# EAGLE design main (EAGLE 6.1)
AUTHOR: Chaiporn Jaikaeo; REV: 1
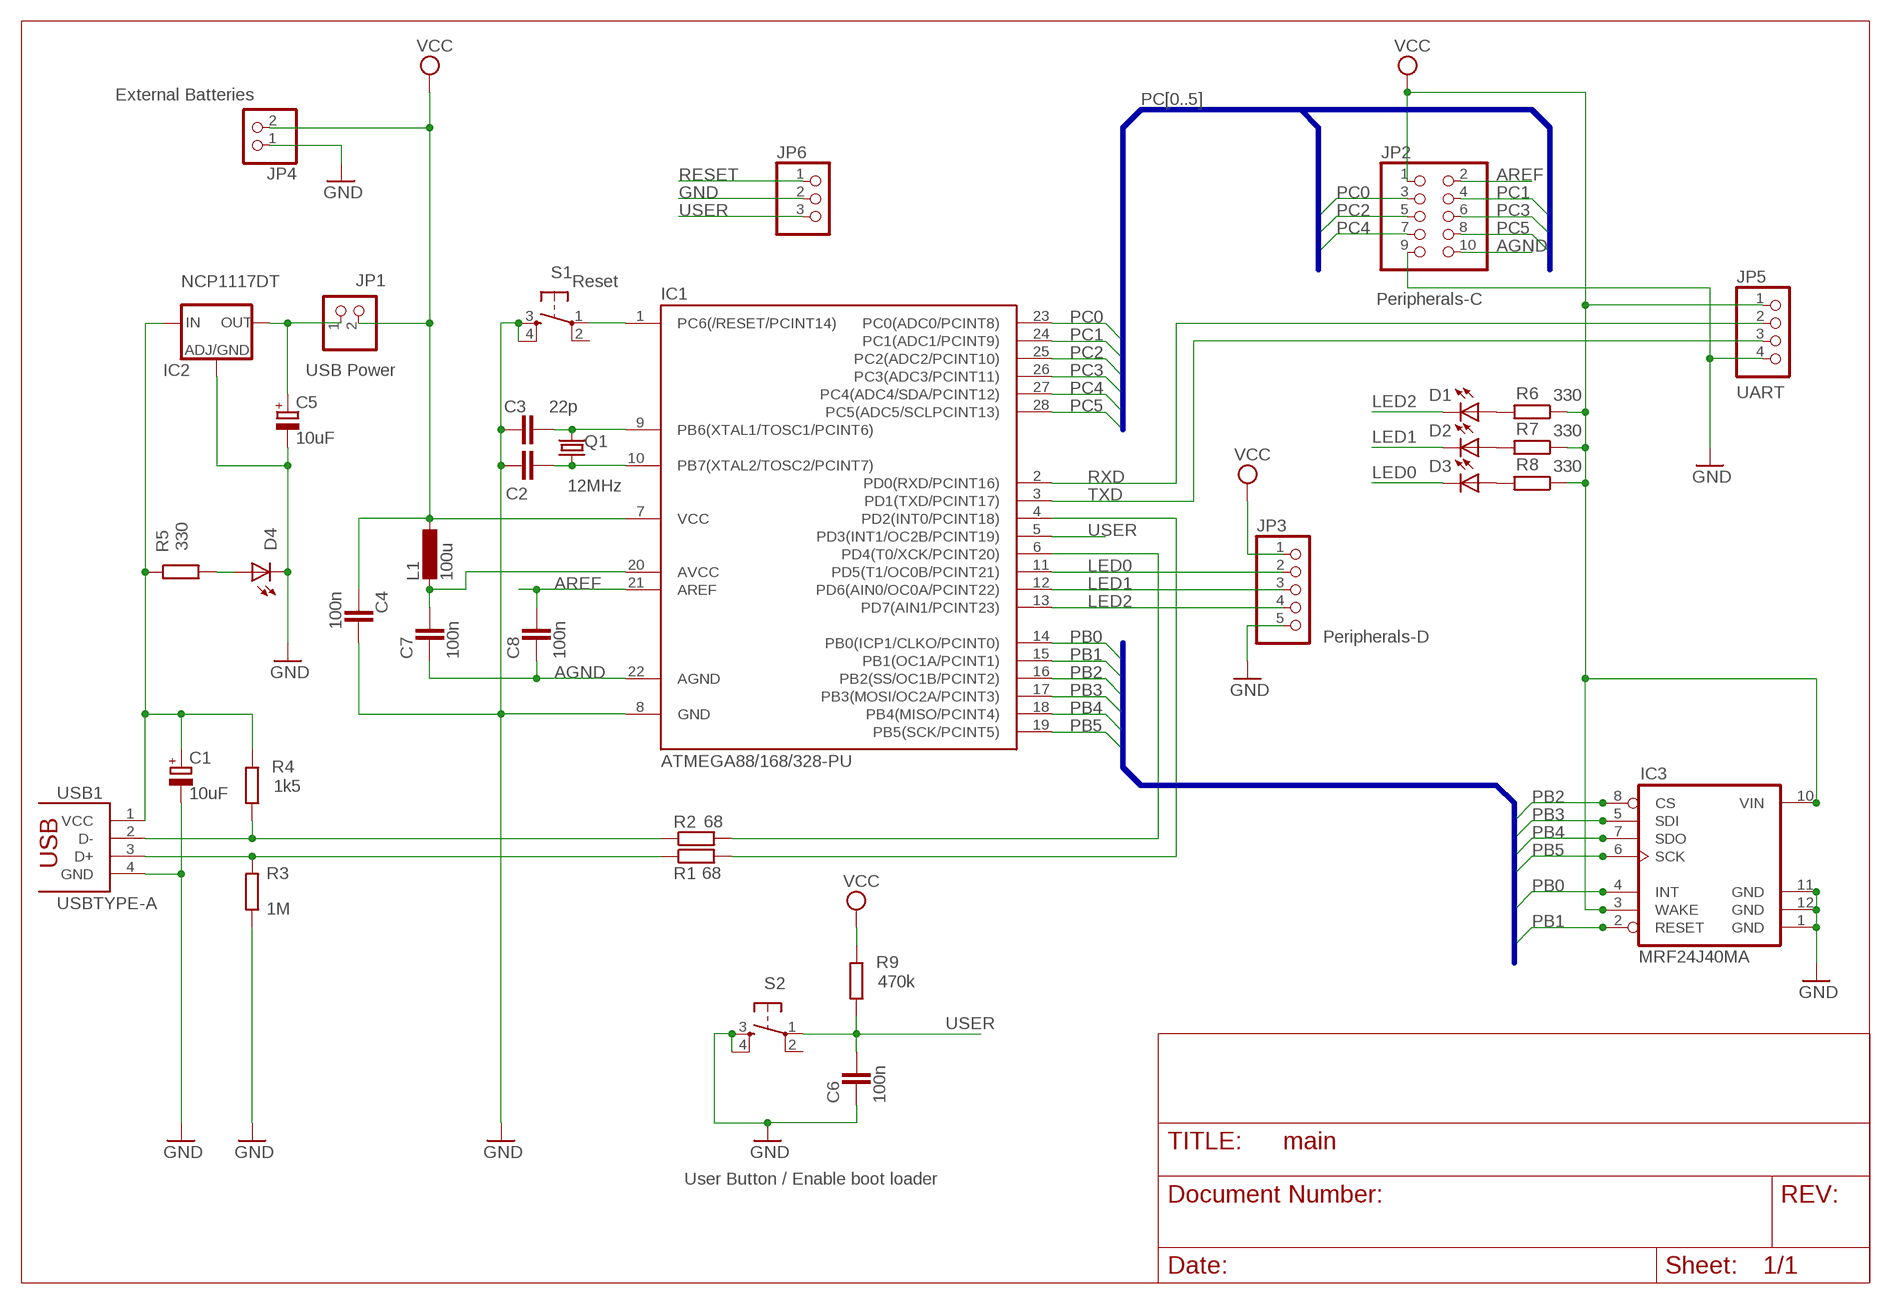
[diagram p0: schematic, sheet 1]

## Parts
C1  10uF  CPOL-EUE2,5-6E  [E2,5-6E]
C2  22p  C-EU025-024X044  [C025-024X044]
C3  22p  C-EU025-024X044  [C025-024X044]
C4  100n  C-EU050-024X044  [C050-024X044]
C5  10uF  CPOL-EUE2,5-6E  [E2,5-6E]
C6  100n  C-EU050-024X044  [C050-024X044]
C7  100n  C-EU050-024X044  [C050-024X044]
C8  100n  C-EU050-024X044  [C050-024X044]
D1  LED3MM  [LED3MM]
D2  LED3MM  [LED3MM]
D3  LED3MM  [LED3MM]
D4  LED3MM  [LED3MM]
IC1  ATMEGA88/168/328-PU  ATMEGA48/88/168-PU  [DIL28-3]
IC2  NCP1117DT  [DPACK]
IC3  MRF24J40MA/B/C  MRF24J40MAB  [MRF24J40MAB-TH]
JP1  PINHD-1X2  [1X02]
JP2  HEADER-2X5  [2X05]
JP3  PINHD-1X5  [1X05]
JP4  PINHD-1X2  [1X02]
JP5  HEADER-1X4ROUND  [1X04_ROUND]
JP6  PINHD-1X3  [1X03]
L1  100u  L-EU0207/7  [0207/7]
Q1  12MHz  CRYSTALHC49S  [HC49/S]
R1  68  R-EU_0204/5  [0204/5@1]
R2  68  R-EU_0204/5  [0204/5@1]
R3  1M  R-EU_0204/5  [0204/5@1]
R4  1k5  R-EU_0204/5  [0204/5@1]
R5  330  R-EU_0204/7  [0204/7@1]
R6  330  R-EU_0204/5  [0204/5@1]
R7  330  R-EU_0204/5  [0204/5@1]
R8  330  R-EU_0204/5  [0204/5@1]
R9  470k  R-EU_0204/5  [0204/5@1]
S1  DTS-6  [DTS-6]
S2  DTS-6  [DTS-6]
USB1  USBTYPE-A  [USBTYPE-A]

## Nets
AGND: C7.1 C8.1 IC1.22(AGND) JP2.10
AREF: C8.2 IC1.21(AREF) JP2.2
D+: R1.1 R3.2 USB1.3(D+)
D-: R2.1 R4.2 USB1.2(D-)
GND [power]: C1.- C2.1 C3.1 C4.2 C5.- C6.1 D4.K(C) IC1.8(GND) IC2.1(ADJ) IC3.1(GND) IC3.11(GND) IC3.12(GND) IC3.13(GND) IC3.23(GND) IC3.24(GND) JP2.9 JP3.5 JP4.1 JP5.4 JP6.2 R3.1 S1.3 S1.4 S2.3 S2.4 USB1.4(GND)
LED0: D3.K(C) IC1.11(PD5(T1/OC0B/PCINT21)) JP3.2
LED1: D2.K(C) IC1.12(PD6(AIN0/OC0A/PCINT22)) JP3.3
LED2: D1.K(C) IC1.13(PD7(AIN1/PCINT23)) JP3.4
N$1: IC1.4(PD2(INT0/PCINT18)) R1.2
N$3: IC1.6(PD4(T0/XCK/PCINT20)) R2.2
N$4 [power]: C5.+ IC2.4(OUT) JP1.1
N$5: D1.A R6.2
N$6: C7.2 IC1.20(AVCC) L1.1
N$7: D2.A R7.2
N$8: D3.A R8.2
N$9: C2.2 IC1.10(PB7(XTAL2/TOSC2/PCINT7)) Q1.1
N$10: C3.2 IC1.9(PB6(XTAL1/TOSC1/PCINT6)) Q1.2
N$12 [power]: C1.+ IC2.3(IN) R4.1 R5.1 USB1.1(VCC)
N$14: D4.A R5.2
PB0: IC1.14(PB0(ICP1/CLKO/PCINT0)) IC3.4(INT) IC3.16(INT)
PB1: IC1.15(PB1(OC1A/PCINT1)) IC3.2(RESET) IC3.14(RESET)
PB2: IC1.16(PB2(SS/OC1B/PCINT2)) IC3.8(CS) IC3.20(CS)
PB3: IC1.17(PB3(MOSI/OC2A/PCINT3)) IC3.5(SDI) IC3.17(SDI)
PB4: IC1.18(PB4(MISO/PCINT4)) IC3.7(SDO) IC3.19(SDO)
PB5: IC1.19(PB5(SCK/PCINT5)) IC3.6(SCK) IC3.18(SCK)
PC0: IC1.23(PC0(ADC0/PCINT8)) JP2.3
PC1: IC1.24(PC1(ADC1/PCINT9)) JP2.4
PC2: IC1.25(PC2(ADC2/PCINT10)) JP2.5
PC3: IC1.26(PC3(ADC3/PCINT11)) JP2.6
PC4: IC1.27(PC4(ADC4/SDA/PCINT12)) JP2.7
PC5: IC1.28(PC5(ADC5/SCLPCINT13)) JP2.8
RESET: IC1.1(PC6(/RESET/PCINT14)) JP6.1 S1.1
RXD: IC1.2(PD0(RXD/PCINT16)) JP5.2
TXD: IC1.3(PD1(TXD/PCINT17)) JP5.3
USER: C6.2 IC1.5(PD3(INT1/OC2B/PCINT19)) JP6.3 R9.2 S2.1
VCC [power]: C4.1 IC1.7(VCC) IC3.3(WAKE) IC3.10(VIN) IC3.15(WAKE) IC3.22(VIN) JP1.2 JP2.1 JP3.1 JP4.2 JP5.1 L1.2 R6.1 R7.1 R8.1 R9.1
Unconnected: S1.2 S2.2

## Buses
PB[0..5]
PC[0..5]

## Notes on the sheet
- External Batteries
- Reset
- Peripherals-C
- USB Power
- UART
- Peripherals-D
- User Button / Enable boot loader

## Library data of the parts
C1 C5 = rcl:CPOL-EU: POLARIZED CAPACITOR, European symbol
C2-C4 C6-C8 = rcl:C-EU: CAPACITOR, European symbol
D1-D4 = led:LED: LED OSRAM: - CHIPLED LG R971, LG N971, LY N971, LG Q971, LY Q971, LO R971, LY R971 LH N974, LH R974 LS Q976, LO Q976, LY Q976 LO Q996 - Hyper CHIPLED LW Q18S LB Q993, LB Q99A, LB R99A - SideLED LS A670, LO A670, LY A670, LG A670, LP A670 LB A673, LV A673, LT A673, LW A673 LH A674 LY A675 LS A676, LA A676, LO A676, LY A676, LW A676 LS A679, LY A679, LG A679 - Hyper Micro SIDELED® LS Y876, LA Y876, LO Y876, LY Y876 LT Y87S - SmartLED LW L88C, LW L88S LB L89C, LB L89S, LG L890 LS L89K, LO L89K, LY L89K LS L896, LA L896, LO L896, LY L896 - TOPLED LS T670, LO T670, LY T670, LG T670, LP T670 LSG T670, LSP T670, LSY T670, LOP T670, LYG T670 LG T671, LOG T671, LSG T671 LB T673, LV T673, LT T673, LW T673 LH T674 LS T676, LA T676, LO T676, LY T676, LB T676, LH T676, LSB T676, LW T676 LB T67C, LV T67C, LT T67C, LS T67K, LO T67K, LY T67K, LW E67C LS E67B, LA E67B, LO E67B, LY E67B, LB E67C, LV E67C, LT E67C LW T67C LS T679, LY T679, LG T679 LS T770, LO T770, LY T770, LG T770, LP T770 LB T773, LV T773, LT T773, LW T773 LH T774 LS E675, LA E675, LY E675, LS T675 LS T776, LA T776, LO T776, LY T776, LB T776 LHGB T686 LT T68C, LB T68C - Hyper Mini TOPLED® LB M676 - Mini TOPLED Santana® LG M470 LS M47K, LO M47K, LY M47K Source: http://www.osram.convergy.de LUXEON: - LUMILED® LXK2-PW12-R00, LXK2-PW12-S00, LXK2-PW14-U00, LXK2-PW14-V00 LXK2-PM12-R00, LXK2-PM12-S00, LXK2-PM14-U00 LXK2-PE12-Q00, LXK2-PE12-R00, LXK2-PE12-S00, LXK2-PE14-T00, LXK2-PE14-U00 LXK2-PB12-K00, LXK2-PB12-L00, LXK2-PB12-M00, LXK2-PB14-N00, LXK2-PB14-P00, LXK2-PB14-Q00 LXK2-PR12-L00, LXK2-PR12-M00, LXK2-PR14-Q00, LXK2-PR14-R00 LXK2-PD12-Q00, LXK2-PD12-R00, LXK2-PD12-S00 LXK2-PH12-R00, LXK2-PH12-S00 LXK2-PL12-P00, LXK2-PL12-Q00, LXK2-PL12-R00 Source: www.luxeon.com KINGBRIGHT: KA-3528ASYC Source: www.kingbright.com
IC1 = atmega8:ATMEGA48/88/168-PU
IC2 = iwing-mrf:NCP1117: Low drop-out positive fixed and adjustable voltage regulator
IC3 = iwing-mrf:MRF24J40MAB
JP1 JP4 = pinhead:PINHD-1X2: PIN HEADER
JP2 = microbuilder:HEADER-2X5: PIN HEADER
JP3 = pinhead:PINHD-1X5: PIN HEADER
JP5 = microbuilder:HEADER-1X4: PIN HEADER
JP6 = pinhead:PINHD-1X3: PIN HEADER
L1 = rcl:L-EU: INDUCTOR, European symbol
Q1 = crystal:CRYSTAL: CRYSTAL
R1-R9 = rcl:R-EU_: RESISTOR, European symbol
S1 S2 = switch-tact:DTS-6
USB1 = USBTYPE-A:USBTYPE-A

## Net classes
0 default: width 0.254 mm
1 power: width 0.406 mm, clearance 0.203 mm

## Board
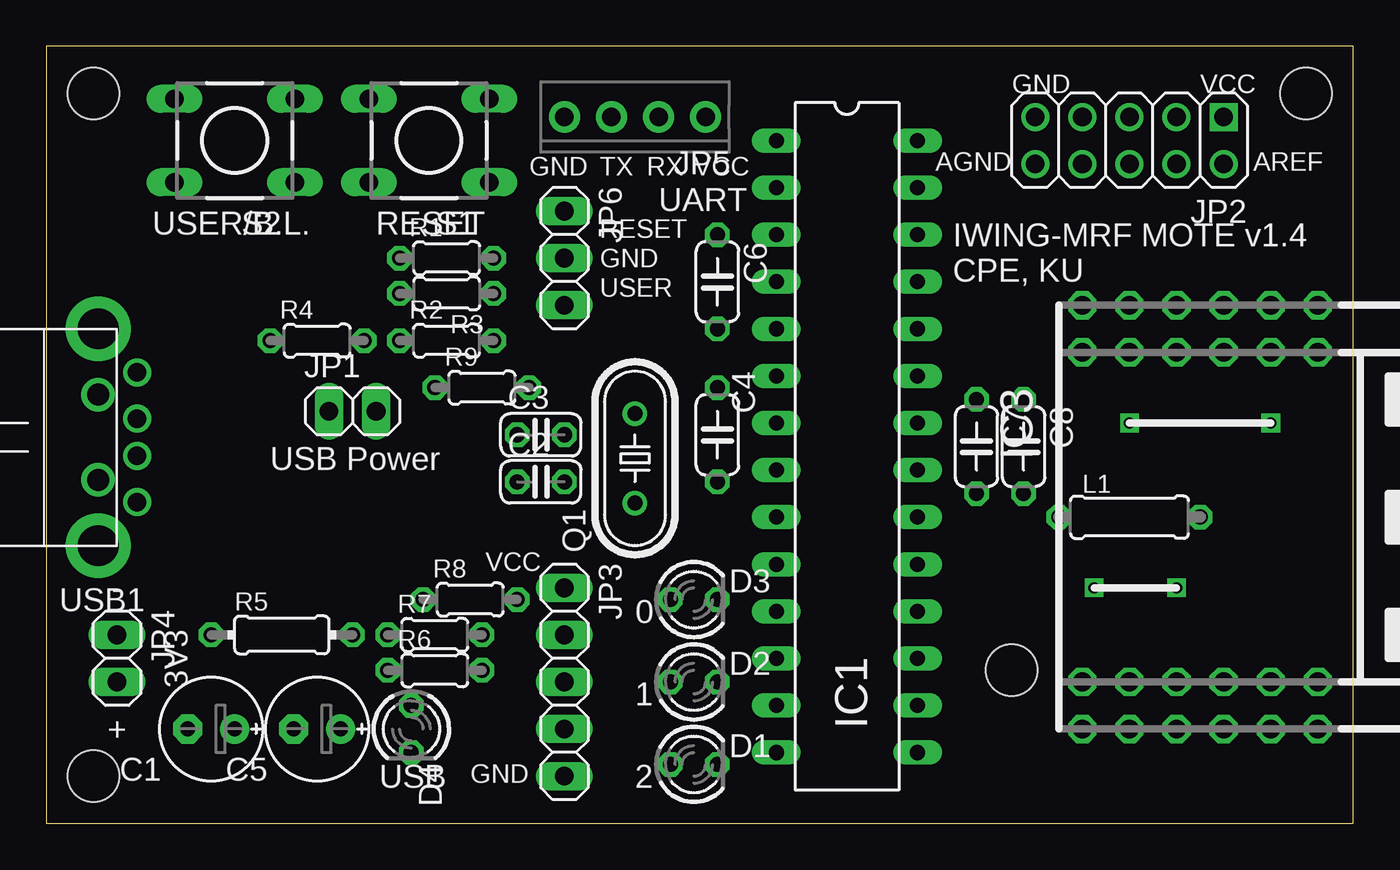
[diagram p1: board, top side]
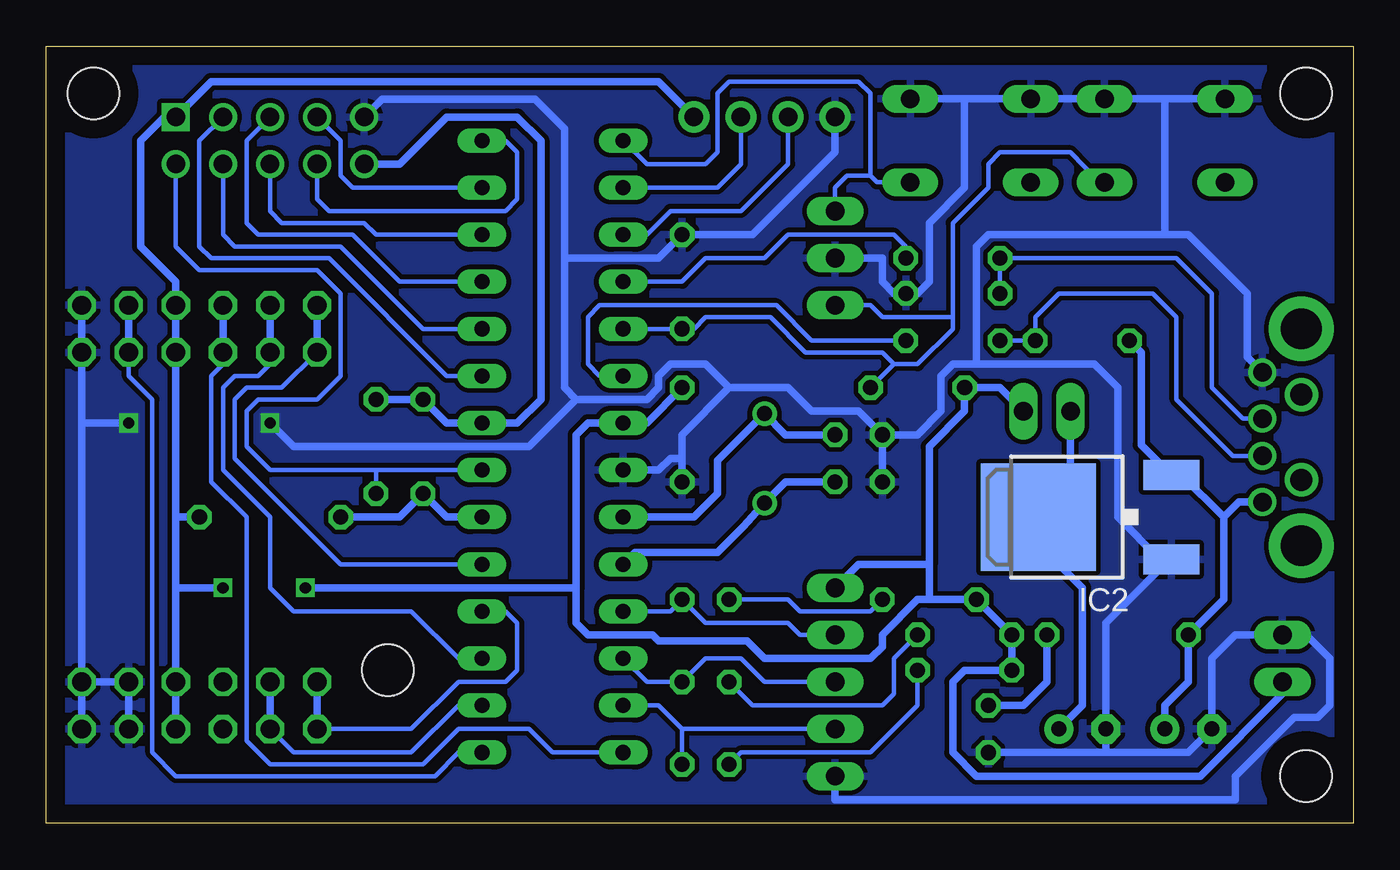
[diagram p2: board, bottom side, seen from below]

Size 70.48 x 41.91 mm. Coordinates in mm from the lower left corner, seen from the top.
Outline: 0,0 70.48,0 70.48,41.91 0,41.91 0,0
Copper layers (1*16): Top 0.035mm / dielectric 1.5mm / Bottom 0.035mm
Design rules: minimum track width 10mil, minimum drill 24mil, track to track 10mil, track to pad 10mil, pad to pad 10mil, via to via 10mil, smd to smd 8mil, copper to edge 40mil, drill to drill 8mil, minimum pad ring 10mil, minimum via ring 8mil, stop-mask expansion 4mil, vias tented up to drill 0mil, thermal gap 10mil
Holes 2.8 mm at 2.54,39.37 2.54,2.54 67.94,39.37 52.07,8.26

### Footprints (pad centres in the part's own frame; a part is rotated, then mirrored left to right if it is on the bottom)
E2,5-6E = drill 0.813 pad 1.575: + -1.27,0 | drill 0.813 pad 1.575 octagon: - 1.27,0
C025-024X044 = drill 0.813 octagon: 1 -1.27,0; 2 1.27,0
C050-024X044 = drill 0.813 octagon: 1 -2.54,0; 2 2.54,0
LED3MM = drill 0.813 octagon: A -1.27,0; K 1.27,0
DIL28-3 = drill 0.813 long: 1 -16.51,-3.81; 2 -13.97,-3.81; 3 -11.43,-3.81; 4 -8.89,-3.81; 5 -6.35,-3.81; 6 -3.81,-3.81; 7 -1.27,-3.81; 8 1.27,-3.81; 9 3.81,-3.81; 10 6.35,-3.81; 11 8.89,-3.81; 12 11.43,-3.81; 13 13.97,-3.81; 14 16.51,-3.81; 15 16.51,3.81; 16 13.97,3.81; 17 11.43,3.81; 18 8.89,3.81; 19 6.35,3.81; 20 3.81,3.81; 21 1.27,3.81; 22 -1.27,3.81; 23 -3.81,3.81; 24 -6.35,3.81; 25 -8.89,3.81; 26 -11.43,3.81; 27 -13.97,3.81; 28 -16.51,3.81
DPACK = smd 1.6 x 3: 1 -2.28,-4.8; 3 2.28,-4.8 | smd 5.8 x 6.2: 4 0,2.38
MRF24J40MAB-TH = drill 1.016 octagon: 1 -8.89,5.08; 2 -8.89,2.54; 3 -8.89,0; 4 -8.89,-2.54; 5 -8.89,-5.08; 6 -8.89,-7.62; 7 8.89,-7.62; 8 8.89,-5.08; 9 8.89,-2.54; 10 8.89,0; 11 8.89,2.54; 12 8.89,5.08; 13 -11.43,5.08; 14 -11.43,2.54; 15 -11.43,0; 16 -11.43,-2.54; 17 -11.43,-5.08; 18 -11.43,-7.62; 19 11.43,-7.62; 20 11.43,-5.08; 21 11.43,-2.54; 22 11.43,0; 23 11.43,2.54; 24 11.43,5.08
1X02 = drill 1.016 long: 1 -1.27,0; 2 1.27,0
2X05 = drill 1 square: 1 -5.08,-1.27 | drill 1: 2 -5.08,1.27; 3 -2.54,-1.27; 4 -2.54,1.27; 5 0,-1.27; 6 0,1.27; 7 2.54,-1.27; 8 2.54,1.27; 9 5.08,-1.27; 10 5.08,1.27
1X05 = drill 1.016 long: 1 -5.08,0; 2 -2.54,0; 3 0,0; 4 2.54,0; 5 5.08,0
1X04_ROUND = drill 1 pad 1.676: 1 -3.81,0; 2 -1.27,0; 3 1.27,0; 4 3.81,0
1X03 = drill 1.016 long: 1 -2.54,0; 2 0,0; 3 2.54,0
0207/7 = drill 0.813 octagon: 1 -3.81,0; 2 3.81,0
HC49/S = drill 0.813: 1 -2.413,0; 2 2.413,0
0204/5@1 = drill 0.813 octagon: 1 -2.54,0; 2 2.54,0
0204/7@1 = drill 0.813 octagon: 1 -3.81,0; 2 3.81,0
DTS-6 = drill 1 long: 1 -3.25,2.25; 2 3.25,2.25; 3 -3.25,-2.25; 4 3.25,-2.25
USBTYPE-A = drill 1: 1 -2.1,9.35; 2 -2.1,6.85; 3 -2.1,4.85; 4 -2.1,2.35 | drill 2.2 pad 3.5: GND@1 0,0; GND@2 0,11.7 | drill 1.2 pad 1.6: S1 0,3.55; S2 0,8.15

### Placement (x,y rotation side)
C1  8.89,5.08 180 top
C2  26.67,18.41 0 top
C3  26.67,20.95 0 top
C4  36.2,20.95 270 top
C5  14.61,5.08 180 top
C6  36.2,29.21 270 top
C7  50.16,20.32 270 top
C8  52.7,20.32 270 top
D1  34.92,3.17 0 top
D2  34.92,7.62 0 top
D3  34.92,12.06 0 top
D4  19.68,5.08 270 top
IC1  43.18,20.32 270 top
IC2  14.61,16.51 90 bottom
IC3  63.5,16.51 270 top
JP1  16.51,22.23 0 top
JP2  58.42,36.83 180 top
JP3  27.94,7.62 270 top
JP4  3.81,8.89 270 top
JP5  31.75,38.1 180 top
JP6  27.94,30.48 270 top
L1  58.42,16.51 0 top
Q1  31.75,19.68 90 top
R1  21.59,30.48 0 top
R2  21.59,26.04 0 top
R3  21.59,28.57 180 top
R4  14.61,26.04 0 top
R5  12.7,10.16 0 top
R6  20.95,8.26 0 top
R7  20.95,10.16 0 top
R8  22.86,12.06 0 top
R9  23.5,23.5 0 top
S1  20.64,36.83 180 top
S2  10.16,36.83 180 top
USB1  2.79,26.67 180 top

### Tracks (layer width: path | path; a pad name or v marks a point on that pad's centre or on a via)
AGND
  Bottom 0.406: C8.1 C7.1 48.9,21.59 IC1.22 45.09,21.59 43.81,22.86 43.81,36.83 45.09,38.1 48.9,38.1 51.44,35.56 JP2.10
AREF
  Bottom 0.254: IC1.21 52.7,19.05 | 52.7,19.05 58.42,19.05 59.69,20.32 59.69,22.23 59.05,22.86 55.88,22.86 54.61,24.13 54.61,28.57 55.88,29.84 62.23,29.84 63.5,31.11 JP2.2 | C8.2 52.7,19.05
D+
  Bottom 0.254: R3.2 R1.1 9.53,30.48 7.62,28.57 7.62,23.5 5.95,21.82 USB1.3
D-
  Bottom 0.254: R2.1 R4.2 17.14,27.3 15.88,28.57 10.79,28.57 9.53,27.3 9.53,22.86 6.49,19.82 USB1.2
GND  (via drill 0.6)
  Top 0.406: v58.42,21.59 v66.04,21.59
  Bottom 0.406: IC3.12 IC3.11 IC3.23 | IC3.12 68.58,21.59 | 13.34,3.81 D4.K | 13.34,3.81 C5.- 13.34,10.79 10.42,13.71 10.42,14.23 | 13.34,3.81 8.89,3.81 C1.- 7.62,8.89 6.35,10.16 JP4.1 2.54,10.16 1.27,8.89 1.27,6.35 1.91,5.71 3.17,5.71 6.35,2.54 6.35,1.27 27.94,1.27 JP3.5 | USB1.4 5.71,25.14 5.71,28.57 8.89,31.75 10.16,31.75 | IC3.12 IC3.24 | IC3.13 IC3.1 68.58,21.59 | 20.32,24.77 21.59,24.77 22.23,24.13 22.23,22.23 23.5,20.95 C3.1 | 20.32,24.77 13.97,24.77 12.7,23.5 12.7,16.51 10.42,14.23 | 10.42,14.23 IC2.1 | C2.1 C3.1 | 33.66,23.5 30.48,23.5 29.21,22.23 26.67,22.23 C3.1 | 20.32,24.77 20.32,31.11 19.68,31.75 10.16,31.75 | v66.04,21.59 68.58,21.59 | C4.2 36.2,19.68 | S2.4 10.16,39.08 | 10.16,39.08 S2.3 S1.4 20.95,39.08 | 42.55,30.48 37.47,30.48 C6.1 32.38,31.75 27.94,36.2 JP5.4 | S1.3 20.95,39.08 | 20.95,39.08 20.95,34.29 22.86,32.38 22.86,29.21 23.5,28.57 R3.1 24.77,28.57 25.4,29.21 25.4,30.48 JP6.2 | 33.66,23.5 36.2,20.95 36.2,19.68 | 33.66,23.5 34.92,24.77 36.83,24.77 37.47,24.13 37.47,23.5 38.1,22.86 41.91,22.86 | 10.16,31.75 10.16,39.08 | 41.91,22.86 42.55,23.5 42.55,30.48 | 42.55,30.48 42.55,37.47 44.13,39.05 52.39,39.05 JP2.9 | 41.91,22.86 44.45,20.32 57.15,20.32 v58.42,21.59 | 36.2,19.68 36.83,19.68 37.47,19.05 IC1.8
  pour Bottom: 0,0 0,41.91 70.48,41.91 70.48,0
  pour Bottom: 24.13,17.78 24.13,21.59 24.77,22.23 27.3,22.23 30.48,25.4 33.02,25.4 33.66,24.77 33.66,24.77 34.92,23.5 34.92,19.68 36.83,17.78 40.64,17.78 41.27,17.14 41.27,13.34 40.64,12.7 38.1,12.7 37.47,13.34 34.29,13.34 33.66,13.97 29.84,13.97 29.21,14.61 29.21,16.51 28.57,17.14 24.77,17.14
LED0
  Bottom 0.254: IC1.11 36.83,11.43 D3.K 34.92,10.79 30.48,10.79 29.84,10.16 JP3.2
LED1
  Bottom 0.254: IC1.12 38.1,7.62 D2.K 34.92,8.89 33.02,8.89 31.75,7.62 JP3.3
LED2
  Bottom 0.254: IC1.13 37.47,6.35 36.2,5.08 | 36.2,5.08 D1.K | JP3.4 36.2,5.08
N$1
  Bottom 0.254: IC1.4 36.2,29.21 34.92,30.48 31.75,30.48 30.48,31.75 24.77,31.75 24.13,31.11 R1.2
N$3
  Bottom 0.254: R2.2 29.21,26.04 31.11,27.94 40.64,27.94 41.27,27.3 41.27,24.77 40.64,24.13 IC1.6
N$4
  Bottom 0.406: C5.+ 14.61,6.35 14.61,12.7 15.88,13.97 15.88,15.4 IC2.4 17.62,16.98 16.51,17.14 15.24,18.41 JP1.1
N$5
  Bottom 0.254: R6.2 23.5,6.35 26.04,3.81 33.02,3.81 D1.A
N$6
  Bottom 0.406: IC1.20 48.9,16.51 C7.2 51.44,16.51 L1.1
N$7
  Bottom 0.254: D2.A 32.38,6.35 25.4,6.35 24.77,6.99 24.77,8.89 R7.2
N$8
  Bottom 0.254: R8.2 26.04,11.43 29.21,11.43 29.84,11.43 30.48,12.06 32.38,12.06 D3.A
N$9
  Bottom 0.406: IC1.10 38.73,14.61 34.29,14.61 32.89,16 Q1.1 30.61,18.41 C2.2
N$10
  Bottom 0.406: C3.2 30.61,20.95 Q1.2 34.29,19.56 34.29,17.78 35.56,16.51 IC1.9
N$12
  Bottom 0.406: R4.1 11.43,25.4 11.43,20.41 IC2.3 9.27,18.79 6.99,16.51 | 6.99,16.51 6.99,12.06 R5.1 8.89,7.62 10.16,6.35 C1.+ | USB1.1 6.17,17.32 6.99,16.51
N$14
  Bottom 0.406: R5.2 16.51,7.62 17.78,6.35 D4.A
PB0
  Bottom 0.254: IC1.14 43.18,3.81 44.45,5.08 48.26,5.08 50.16,3.17 58.42,3.17 59.69,4.45 59.69,16.51 61.59,18.41 61.59,24.13 60.96,24.77 IC3.4
  Bottom 0.406: IC3.4 IC3.16
PB1
  Bottom 0.254: IC1.15 48.26,3.81 49.53,2.54 63.5,2.54 64.77,3.81 64.77,22.86 66.04,24.13 IC3.2
  Bottom 0.406: IC3.2 IC3.14
PB2
  Bottom 0.254: IC1.16 48.26,6.35 50.8,3.81 57.15,3.81 IC3.20
  Bottom 0.406: IC3.20 IC3.8
PB3
  Bottom 0.254: IC1.17 48.26,8.89 50.8,11.43 57.15,11.43 58.42,12.7 58.42,16.51 60.96,19.05 60.96,23.5 60.33,24.13 59.05,24.13 58.42,24.77 IC3.5
  Bottom 0.406: IC3.5 IC3.17
PB4
  Bottom 0.254: IC1.18 45.72,11.43 45.09,10.79 45.09,8.26 45.72,7.62 48.26,7.62 50.8,5.08 IC3.19
  Bottom 0.406: IC3.19 IC3.7
PB5
  Bottom 0.254: IC1.19 54.61,13.97 60.33,19.68 60.33,22.86 59.69,23.5 57.78,23.5 IC3.6
  Bottom 0.406: IC3.6 IC3.18
PC0
  Bottom 0.254: IC1.23 48.9,24.13 55.24,30.48 61.59,30.48 62.23,31.11 62.23,36.83 JP2.3
PC1
  Bottom 0.254: IC1.24 50.16,26.67 54.61,31.11 60.33,31.11 60.96,31.75 JP2.4
PC2
  Bottom 0.254: IC1.25 51.44,29.21 53.98,31.75 59.05,31.75 59.69,32.38 59.69,36.83 JP2.5
PC3
  Bottom 0.254: IC1.26 52.7,31.75 53.34,32.38 57.78,32.38 58.42,33.02 JP2.6
PC4
  Bottom 0.254: IC1.27 53.98,34.29 54.61,34.92 54.61,36.83 JP2.7
PC5
  Bottom 0.254: IC1.28 45.72,36.83 45.09,36.2 45.09,33.66 45.72,33.02 55.24,33.02 55.88,33.66 JP2.8
RESET
  Bottom 0.254: S1.1 25.69,34.58 26.04,34.92 | 26.04,34.92 26.04,39.37 26.67,40.01 33.66,40.01 34.29,39.37 34.29,36.2 34.92,35.56 38.1,35.56 IC1.1 | 26.04,34.92 27.3,34.92 27.94,34.29 JP6.1
RXD
  Bottom 0.254: IC1.2 34.29,34.29 33.02,35.56 JP5.2
TXD
  Bottom 0.254: IC1.3 38.1,31.75 36.83,33.02 33.02,33.02 30.48,35.56 JP5.3
USER
  Bottom 0.254: S2.1 13.68,34.58 15.24,36.2 19.05,36.2 19.68,35.56 19.68,34.29 21.59,32.38 21.59,27.3 | 21.59,27.3 21.59,26.67 23.5,24.77 24.77,24.77 | IC1.5 C6.2 35.56,26.67 34.92,27.3 31.43,27.3 29.53,25.4 25.4,25.4 24.77,24.77 | JP6.3 26.04,27.94 25.4,27.3 21.59,27.3 | R9.2 24.77,24.77
VCC  (via drill 0.6)
  Top 0.406: v56.52,12.7 v60.96,12.7
  Bottom 0.406: 63.5,16.51 IC3.3 IC3.15 63.5,29.21 65.41,31.11 65.41,36.83 64.14,38.1 JP2.1 61.59,40.01 37.47,40.01 JP5.1 | 63.5,16.51 63.5,12.7 | 63.5,12.7 IC3.10 IC3.22 | 41.91,12.7 41.91,20.95 41.27,21.59 IC1.7 38.1,21.59 C4.1 | v60.96,12.7 63.5,12.7 | JP1.2 19.05,23.5 R9.1 20.95,22.23 22.86,20.32 22.86,13.97 | 22.86,12.06 R8.1 R7.1 R6.1 20.95,8.26 21.59,7.62 21.59,3.81 20.32,2.54 8.26,2.54 3.81,6.99 JP4.2 | 22.86,12.06 22.86,13.97 | 22.86,13.97 26.67,13.97 JP3.1 | 41.91,12.7 v56.52,12.7 | L1.2 63.5,16.51 | 22.86,12.06 23.5,12.06 25.4,10.16 25.4,9.53 26.04,8.89 31.75,8.89 32.7,9.84 37.47,9.84 37.78,10.16 41.27,10.16 41.91,10.79 41.91,12.7

### Text on the board
tPlace: GND | VCC | AGND | AREF | GND | TX | RX | VCC | UART | USER/B.L. | RESET | RESET | IWING-MRF MOTE v1.4 | GND | USER | CPE, KU | USB Power | VCC | - | 0 | 3V3 | + | 1 | USB | GND | 2
tValues: PERIPHERALS-C | PERIPHERALS-D